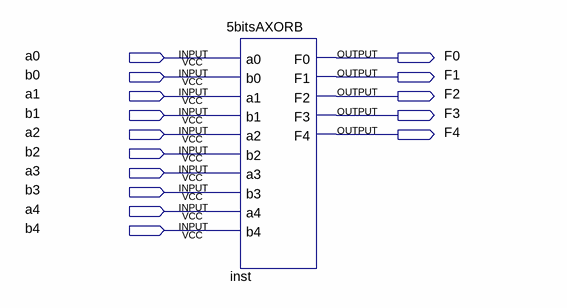
[diagram p0: schematic sheet]
// Quartus schematic 5bitsXOR.bdf as structural Verilog: 1 symbols, 15 pins
module \5bitsXOR  (
  input  a0,
  input  b0,
  input  a1,
  input  b1,
  input  a2,
  input  b2,
  input  a3,
  input  b3,
  input  a4,
  input  b4,
  output F0,
  output F1,
  output F2,
  output F3,
  output F4
);

  \5bitsAXORB  inst (
    .a0(a0), .b0(b0), .a1(a1), .b1(b1), .a2(a2), .b2(b2), .a3(a3), .b3(b3), .a4(a4), .b4(b4), .F0(F0),
    .F1(F1), .F2(F2), .F3(F3), .F4(F4));
endmodule
